# Altium schematic sheet cpuledout.SchDoc
size A4
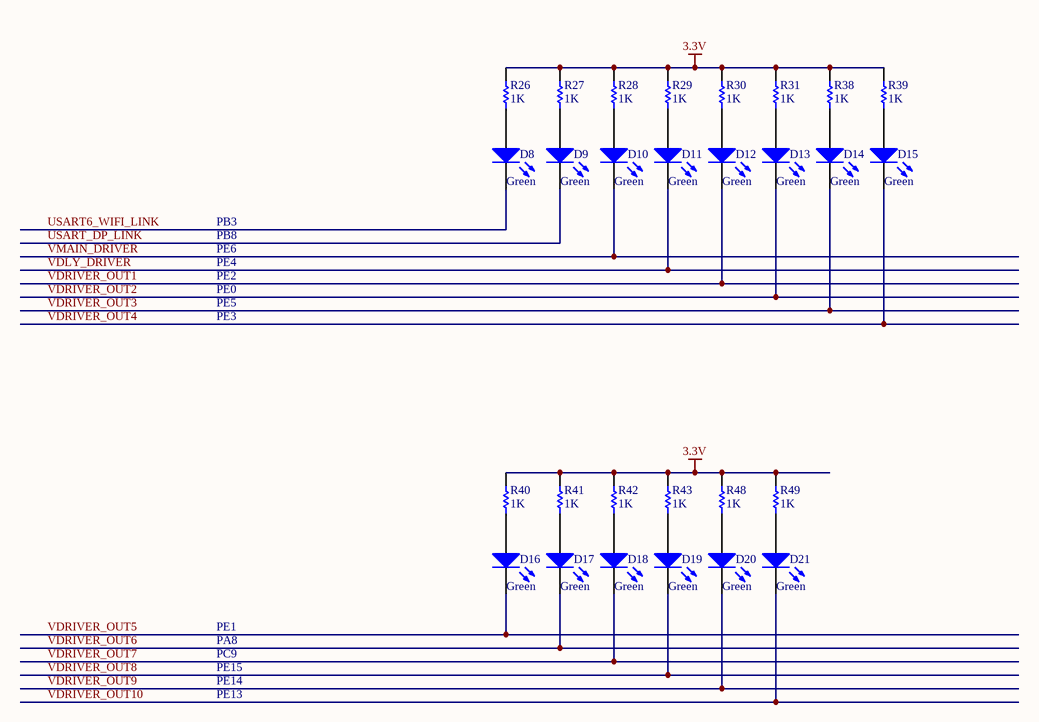
[diagram p0: cpuledout.SchDoc]

## Parts
D8  Green  [CD2012-0805]
D9  Green  [CD2012-0805]
D10  Green  [CD2012-0805]
D11  Green  [CD2012-0805]
D12  Green  [CD2012-0805]
D13  Green  [CD2012-0805]
D14  Green  [CD2012-0805]
D15  Green  [CD2012-0805]
D16  Green  [CD2012-0805]
D17  Green  [CD2012-0805]
D18  Green  [CD2012-0805]
D19  Green  [CD2012-0805]
D20  Green  [CD2012-0805]
D21  Green  [CD2012-0805]
R26  1K  [RESC2012M]
R27  1K  [RESC2012M]
R28  1K  [RESC2012M]
R29  1K  [RESC2012M]
R30  1K  [RESC2012M]
R31  1K  [RESC2012M]
R38  1K  [RESC2012M]
R39  1K  [RESC2012M]
R40  1K  [RESC2012M]
R41  1K  [RESC2012M]
R42  1K  [RESC2012M]
R43  1K  [RESC2012M]
R48  1K  [RESC2012M]
R49  1K  [RESC2012M]

## Nets
3.3V: R26.1 R27.1 R28.1 R29.1 R30.1 R31.1 R38.1 R39.1 R40.1 R41.1 R42.1 R43.1 R48.1 R49.1
USART6_WIFI_LINK: D8.2(K)
USART_DP_LINK: D9.2(K)
VDLY_DRIVER: D11.2(K)
VDRIVER_OUT1: D12.2(K)
VDRIVER_OUT2: D13.2(K)
VDRIVER_OUT3: D14.2(K)
VDRIVER_OUT4: D15.2(K)
VDRIVER_OUT5: D16.2(K)
VDRIVER_OUT6: D17.2(K)
VDRIVER_OUT7: D18.2(K)
VDRIVER_OUT8: D19.2(K)
VDRIVER_OUT9: D20.2(K)
VDRIVER_OUT10: D21.2(K)
VMAIN_DRIVER: D10.2(K)
NetD8_1: D8.1(A) R26.2
NetD9_1: D9.1(A) R27.2
NetD10_1: D10.1(A) R28.2
NetD11_1: D11.1(A) R29.2
NetD12_1: D12.1(A) R30.2
NetD13_1: D13.1(A) R31.2
NetD14_1: D14.1(A) R38.2
NetD15_1: D15.1(A) R39.2
NetD16_1: D16.1(A) R40.2
NetD17_1: D17.1(A) R41.2
NetD18_1: D18.1(A) R42.2
NetD19_1: D19.1(A) R43.2
NetD20_1: D20.1(A) R48.2
NetD21_1: D21.1(A) R49.2

## Notes on the sheet
- PB3
- PB8
- PE6
- PE4
- PE2
- PE0
- PE5
- PE3
- PE1
- PA8
- PC9
- PE15
- PE13
- PE14

## Library data of the parts
D8-D21 = LED1: Green LED,Output indicate.; Published: 8-Jun-2000; LatestRevisionDate: 08-Jul-2005; LatestRevisionNote: Mech Layer 1 removed.; PackageReference: LED-1; Publisher: Altium Limited
R26-R31 R38-R43 R48 R49 = Res1: Resistor; Value: 10K; Published: 8-Jun-2000; LatestRevisionDate: 17-Jul-2002; LatestRevisionNote: Re-released for DXP Platform.; PackageReference: AXIAL-0.3; Publisher: Altium Limited